# EAGLE schematic univ_3-2-3-x-rev2 (EAGLE 7.5.0)
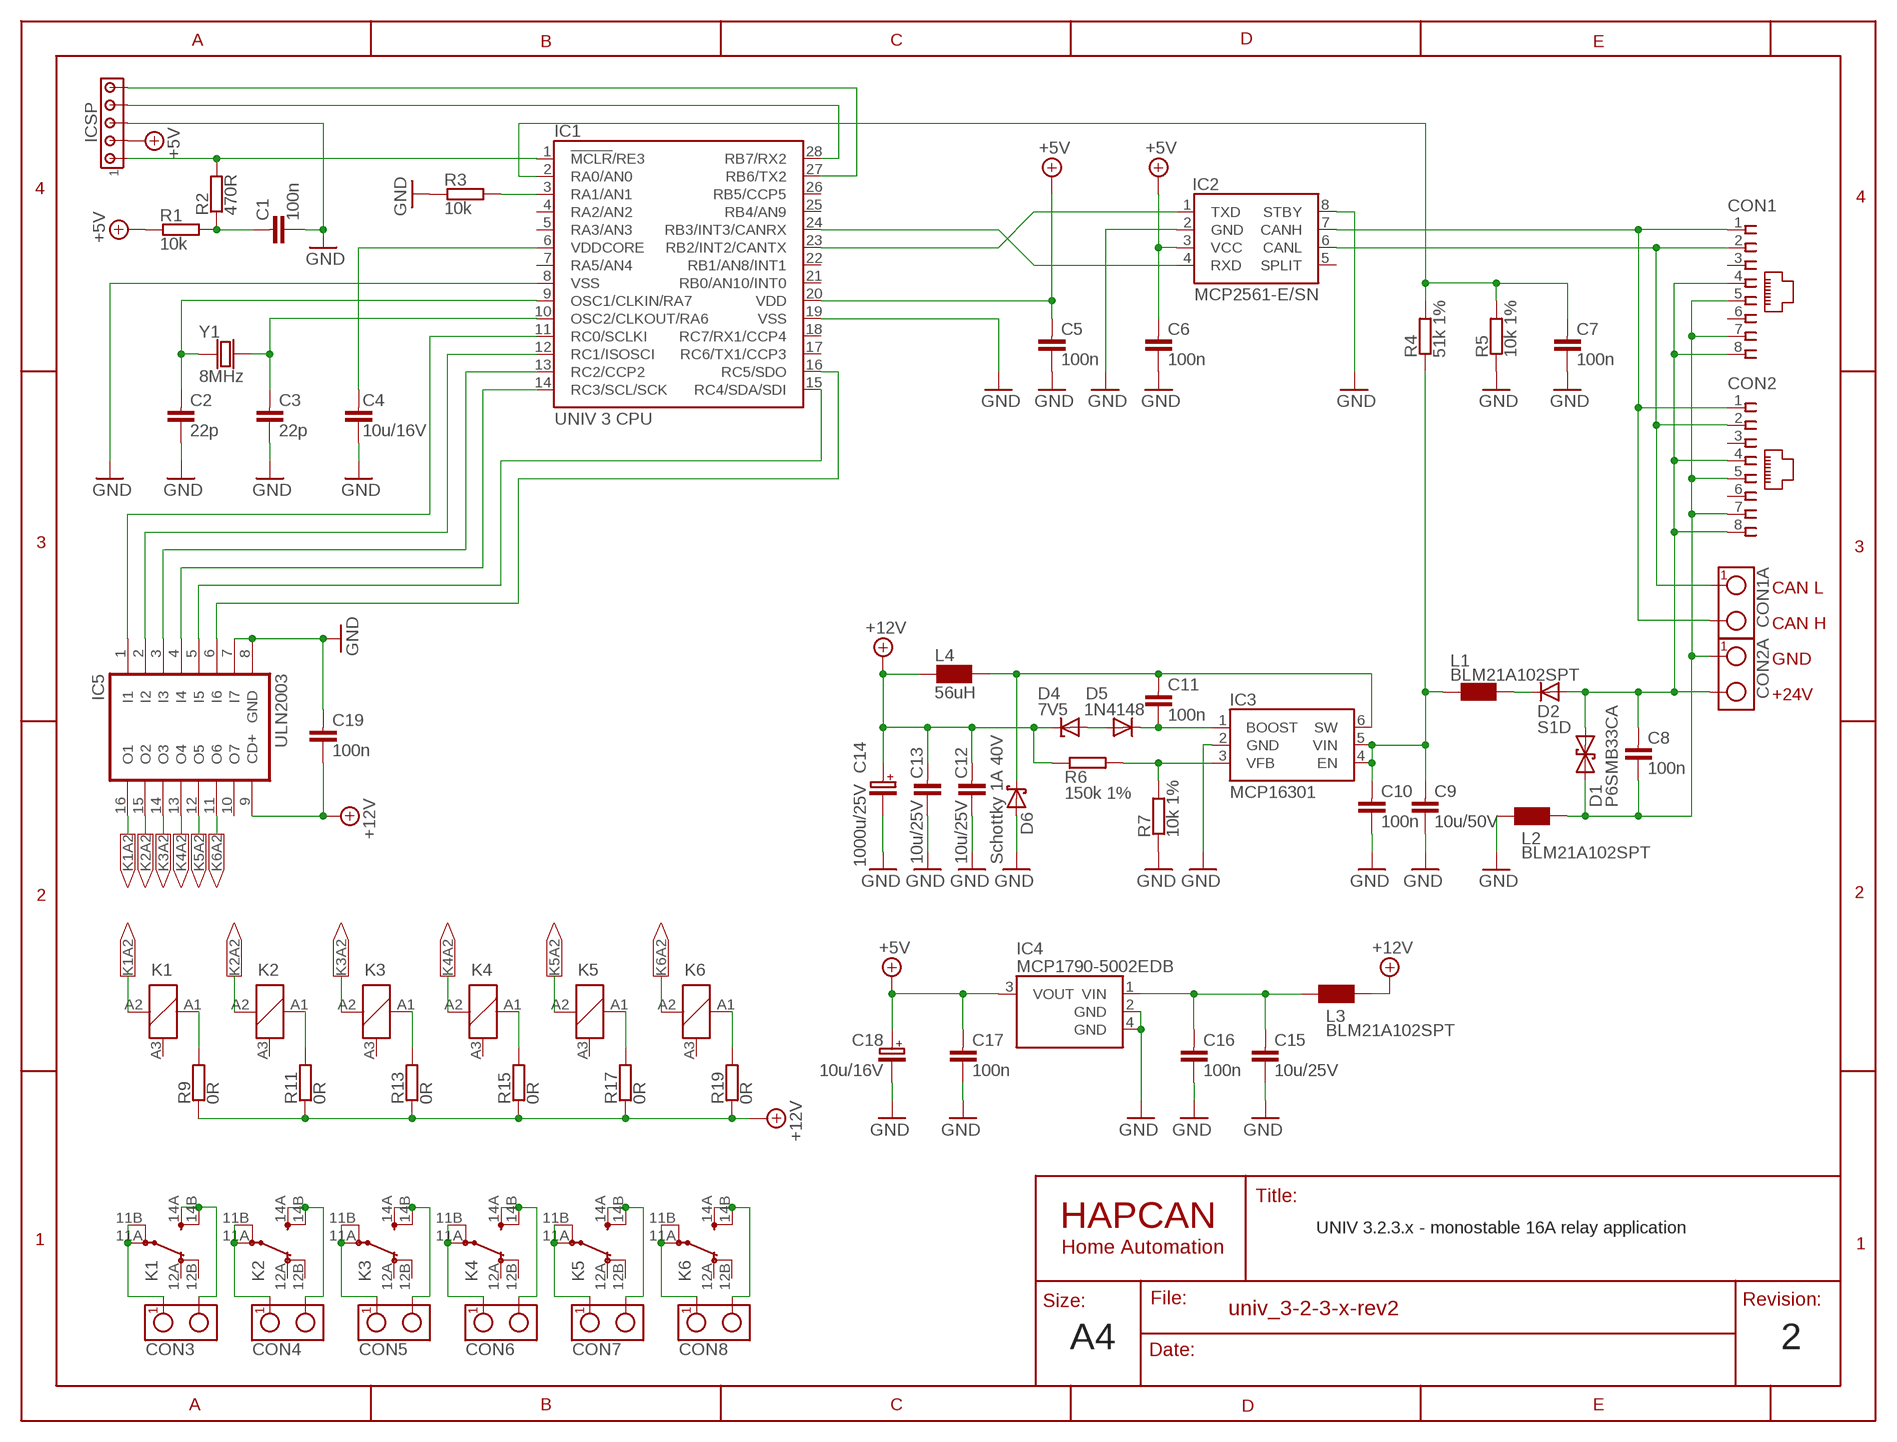
[diagram p0: schematic, sheet 1]
FRAME (HAP_A4): AUTHOR: hapcan.com

## Parts
C1  100n  CAPACITOR0805  [0805]
C2  22p  CAPACITOR0805  [0805]
C3  22p  CAPACITOR0805  [0805]
C4  10u/16V  CAPACITOR0805  [0805]
C5  100n  CAPACITOR0805  [0805]
C6  100n  CAPACITOR0805  [0805]
C7  100n  CAPACITOR0805  [0805]
C8  100n  CAPACITOR0805  [0805]
C9  10u/50V  CAPACITOR1210  [1210]
C10  100n  CAPACITOR0805  [0805]
C11  100n  CAPACITOR0805  [0805]
C12  10u/25V  CAPACITOR1206  [1206]
C13  10u/25V  CAPACITOR1206  [1206]
C14  1000u/25V  CAPACITOR-POLARIZED-5X10.5  [CAP-5X10.5]
C15  10u/25V  CAPACITOR1206  [1206]
C16  100n  CAPACITOR0805  [0805]
C17  100n  CAPACITOR0805  [0805]
C18  10u/16V  CAPACITOR-POLARIZED-SMC_B  [SMC_B]
C19  100n  CAPACITOR0805  [0805]
CON1  RJ45-SOCKET  [RJ45-PCB-SOCKET]
CON1A  TERMINAL-2  TERMINAL-2-5X10,5MM  [ARK2-5X10,5MM]
CON2  RJ45-SOCKET  [RJ45-PCB-SOCKET]
CON2A  TERMINAL-2  TERMINAL-2-5X10,5MM  [ARK2-5X10,5MM]
CON3  TERMINAL-2  TERMINAL-2-7.5X10.5MM  [ARK2-7.5X10.5MM]
CON4  TERMINAL-2  TERMINAL-2-7.5X10.5MM  [ARK2-7.5X10.5MM]
CON5  TERMINAL-2  TERMINAL-2-7.5X10.5MM  [ARK2-7.5X10.5MM]
CON6  TERMINAL-2  TERMINAL-2-7.5X10.5MM  [ARK2-7.5X10.5MM]
CON7  TERMINAL-2  TERMINAL-2-7.5X10.5MM  [ARK2-7.5X10.5MM]
CON8  TERMINAL-2  TERMINAL-2-7.5X10.5MM  [ARK2-7.5X10.5MM]
D1  P6SMB33CA  DIODE_TRANSIL2  [DO-214_TRANSIL2]
D2  S1D  DIODE_DO-214  [DO-214]
D4  7V5  DIODE_ZENER_SOD-80  [SOD-80]
D5  1N4148  DIODE_0805  [0805]
D6  Schottky 1A 40V  DIODE_TRANSIL1_DO214  [DO-214]
IC1  UNIV 3 CPU  UNIV3CPU-I/SO  [UNIV3CPU]
IC2  MCP2561-E/SN  [SO-08]
IC3  MCP16301  MCP16301SOT23-6  [SOT-23-6]
IC4  MCP1790-5002EDB  MCP1826SOT223-3  [SOT-223]
IC5  ULN2003  [SO-16]
ICSP  HEADER5  [SIP-5]
K1  RELAY_RT  [RELAY_RT]
K2  RELAY_RT  [RELAY_RT]
K3  RELAY_RT  [RELAY_RT]
K4  RELAY_RT  [RELAY_RT]
K5  RELAY_RT  [RELAY_RT]
K6  RELAY_RT  [RELAY_RT]
L1  BLM21A102SPT  CHOKE0805  [0805]
L2  BLM21A102SPT  CHOKE0805  [0805]
L3  BLM21A102SPT  CHOKE0805  [0805]
L4  56uH  CHOKEDER0705  [CHOKE-DER0705]
R1  10k  RESISTOR0805  [0805]
R2  470R  RESISTOR0805  [0805]
R3  10k  RESISTOR0805  [0805]
R4  51k 1%  RESISTOR0805  [0805]
R5  10k 1%  RESISTOR0805  [0805]
R6  150k 1%  RESISTOR0805  [0805]
R7  10k 1%  RESISTOR0805  [0805]
R9  0R  RESISTOR1206  [1206]
R11  0R  RESISTOR1206  [1206]
R13  0R  RESISTOR1206  [1206]
R15  0R  RESISTOR1206  [1206]
R17  0R  RESISTOR1206  [1206]
R19  0R  RESISTOR1206  [1206]
Y1  8MHz  CRYSTAL-HC49V  [CRYSTAL-HC49V]

## Nets
+5V: C5.1 C6.1 C17.1 C18.+ IC1.20(VDD) IC2.3(VCC) IC4.3(VOUT) ICSP.2 R1.1
+12V: C12.1 C13.1 C14.+ C19.2 D4.C IC5.9(CD+) L3.2 L4.1 R6.1 R9.1 R11.1 R13.1 R15.1 R17.1 R19.1
GND: C1.2 C2.2 C3.2 C4.2 C5.2 C6.2 C7.2 C9.2 C10.2 C12.2 C13.2 C14.- C15.2 C16.2 C17.2 C18.- C19.1 D6.A IC1.8(VSS) IC1.19(VSS) IC2.2(GND) IC2.8(STBY) IC3.2(GND) IC4.2(GND) IC4.4(GND) IC5.7(I7) IC5.8(GND) ICSP.3 L2.1 R3.1 R5.1 R7.1
K1A1: K1.A1(S+) R9.2
K1A2: IC5.16(O1) K1.A2(R+)
K2A1: K2.A1(S+) R11.2
K2A2: IC5.15(O2) K2.A2(R+)
K3A1: K3.A1(S+) R13.2
K3A2: IC5.14(O3) K3.A2(R+)
K4A1: K4.A1(S+) R15.2
K4A2: IC5.13(O4) K4.A2(R+)
K5A1: K5.A1(S+) R17.2
K5A2: IC5.12(O5) K5.A2(R+)
K6A1: K6.A1(S+) R19.2
K6A2: IC5.11(O6) K6.A2(R+)
N$1: D2.C L1.2
N$2: IC1.24(RB3/INT3/CANRX) IC2.4(RXD)
N$3: IC1.23(RB2/INT2/CANTX) IC2.1(TXD)
N$4: CON1.1 CON1A.2 CON2.1 IC2.7(CANH)
N$5: C9.1 C10.1 IC3.4(EN) IC3.5(VIN) L1.1 R4.1
N$6: C15.1 C16.1 IC4.1(VIN) L3.1
N$7: C1.1 R1.2 R2.1
N$8: IC1.1(!MCLR!/RE3) ICSP.1 R2.2
N$9: C8.1 CON1.4 CON1.8 CON2.4 CON2.8 CON2A.2 D1.C D2.A
N$10: IC1.28(RB7/RX2) ICSP.4
N$11: IC1.12(RC1/ISOSCI) IC5.2(I2)
N$12: IC1.3(RA1/AN1) R3.2
N$13: C8.2 CON1.5 CON1.7 CON2.5 CON2.7 CON2A.1 D1.A L2.2
N$14: IC1.27(RB6/TX2) ICSP.5
N$15: C3.1 IC1.10(OSC2/CLKOUT/RA6) Y1.2
N$16: C7.1 IC1.2(RA0/AN0) R4.2 R5.2
N$17: C11.1 D6.C IC3.6(SW) L4.2
N$18: IC1.11(RC0/SCLKI) IC5.1(I1)
N$19: IC1.13(RC2/CCP2) IC5.3(I3)
N$20: IC3.3(VFB) R6.2 R7.2
N$22: IC1.14(RC3/SCL/SCK) IC5.4(I4)
N$23: D4.A D5.2(A)
N$24: IC1.15(RC4/SDA/SDI) IC5.5(I5)
N$27: CON1.2 CON1A.1 CON2.2 IC2.6(CANL)
N$30: CON3.1 K1.11A(2:PA) K1.11B(2:PB)
N$32: CON3.2 K1.14A(2:SA) K1.14B(2:SB)
N$38: C11.2 D5.1(C) IC3.1(BOOST)
N$40: C2.1 IC1.9(OSC1/CLKIN/RA7) Y1.1
N$45: IC1.16(RC5/SDO) IC5.6(I6)
N$51: CON4.2 K2.14A(2:SA) K2.14B(2:SB)
N$52: CON5.2 K3.14A(2:SA) K3.14B(2:SB)
N$53: CON6.2 K4.14A(2:SA) K4.14B(2:SB)
N$54: CON7.2 K5.14A(2:SA) K5.14B(2:SB)
N$55: CON8.2 K6.14A(2:SA) K6.14B(2:SB)
N$56: C4.1 IC1.6(VDDCORE)
N$57: CON4.1 K2.11A(2:PA) K2.11B(2:PB)
N$58: CON5.1 K3.11A(2:PA) K3.11B(2:PB)
N$59: CON6.1 K4.11A(2:PA) K4.11B(2:PB)
N$60: CON7.1 K5.11A(2:PA) K5.11B(2:PB)
N$61: CON8.1 K6.11A(2:PA) K6.11B(2:PB)
Unconnected: CON1.3 CON1.6 CON2.3 CON2.6 IC1.4(RA2/AN2) IC1.5(RA3/AN3) IC1.7(RA5/AN4) IC1.17(RC6/TX1/CCP3) IC1.18(RC7/RX1/CCP4) IC1.21(RB0/AN10/INT0) IC1.22(RB1/AN8/INT1) IC1.25(RB4/AN9) IC1.26(RB5/CCP5) IC2.5(SPLIT) IC5.10(O7) K1.12A(2:OA) K1.12B(2:OB) K1.A3(-) K2.12A(2:OA) K2.12B(2:OB) K2.A3(-) K3.12A(2:OA) K3.12B(2:OB) K3.A3(-) K4.12A(2:OA) K4.12B(2:OB) K4.A3(-) K5.12A(2:OA) K5.12B(2:OB) K5.A3(-) K6.12A(2:OA) K6.12B(2:OB) K6.A3(-)

## Notes on the sheet
- CAN L
- CAN H
- GND
- +24V
- UNIV 3.2.3.x - monostable 16A relay application
- A4 | 2

## Library data of the parts
C1-C13 C15-C17 C19 = HAPCAN_devices - UNIV3:CAPACITOR: HAPCAN Capacitor
C14 C18 = HAPCAN_devices - UNIV3:CAPACITOR-POLARIZED: HAPCAN Polarazied Capacitor
CON1 CON2 = HAPCAN_devices - UNIV3:RJ45-SOCKET: HAPCAN RJ45 socket
CON1A CON2A CON3-CON8 = HAPCAN_devices - UNIV3:TERMINAL-2: HAPCAN Terminal Block - 2 way
D1 = HAPCAN_devices - UNIV3:DIODE_TRANSIL2: HAPCAN Bidirectional transil diode
D2 D5 = HAPCAN_devices - UNIV3:DIODE: HAPCAN Rectifier Diode
D4 = HAPCAN_devices - UNIV3:DIODE_ZENER: HAPCAN ZENER DIODE
D6 = HAPCAN_devices - UNIV3:DIODE_TRANSIL1: HAPCAN Unidirectional transil diode
IC1 = HAPCAN_devices - UNIV3:UNIV3CPU: HAPCAN Microcontroller UNIV 3 CPU
IC2 = HAPCAN_devices - UNIV3:MCP2561: HAPCAN CAN Tranceiver
IC3 = HAPCAN_devices - UNIV3:MCP16301: High Voltage Input Integrated Switch Step-Down Regulator
IC4 = HAPCAN_devices - UNIV3:MCP1826: 1000 mA, Low Voltage, Low Quiescent Current LDO Regulator
IC5 = HAPCAN_devices - UNIV3:ULN2003: HAPCAN 7 channel Darlington Array NPN 50V 0.5A
ICSP = HAPCAN_devices - UNIV3:HEADER5: HAPCAN Header 5
K1-K6 = HAPCAN_devices - UNIV3:RELAY_RT: HAPCAN Bistable relay 16A
L1-L4 = HAPCAN_devices - UNIV3:CHOKE: Choke
R1-R7 R9 R11 R13 R15 R17 R19 = HAPCAN_devices - UNIV3:RESISTOR: HAPCAN Resistor
Y1 = HAPCAN_devices - UNIV3:CRYSTAL: HAPCAN Crystal